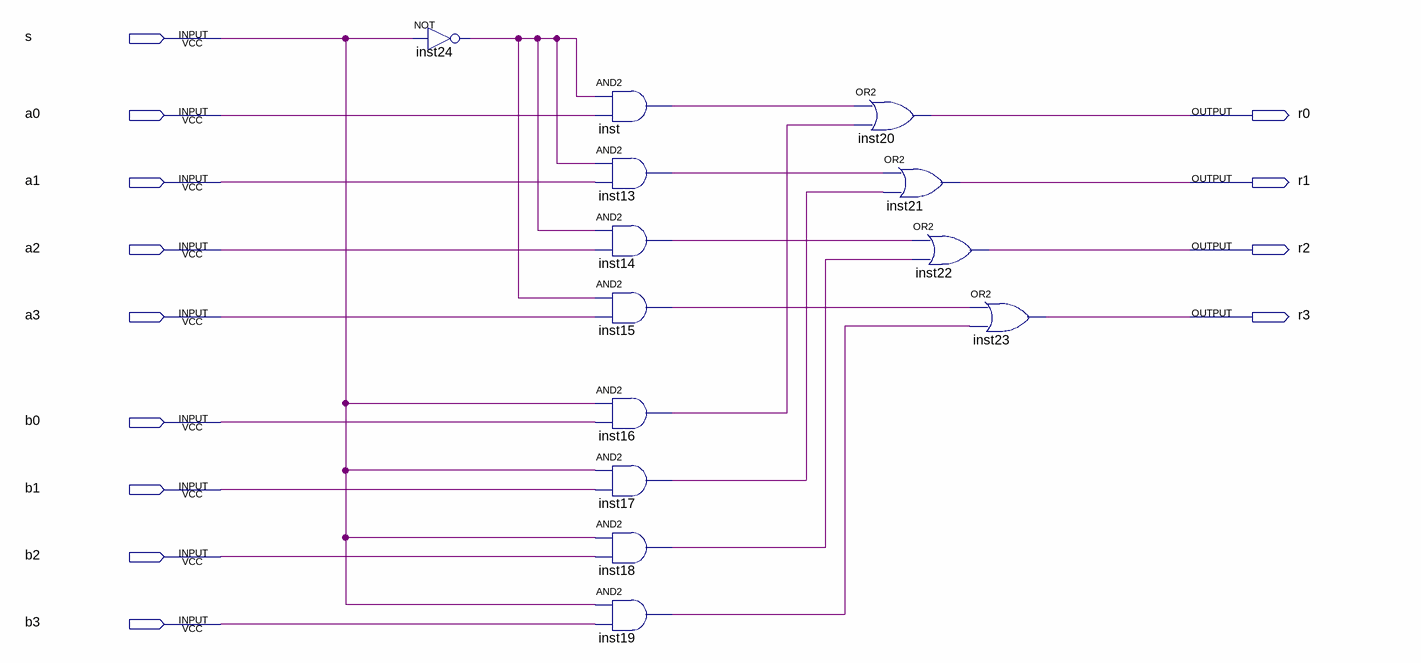
[diagram p0: schematic sheet]
// Quartus schematic demux-4-sd.bdf as structural Verilog: 13 symbols, 13 pins
module \demux-4-sd  (
  input  s,
  input  a0,
  input  a1,
  input  a2,
  input  a3,
  input  b0,
  input  b1,
  input  b2,
  input  b3,
  output r0,
  output r1,
  output r2,
  output r3
);

  wire inst13_out, inst14_out, inst15_out, inst16_out, inst17_out, inst18_out, inst19_out, inst24_out,
       inst_out;

  not inst24 (inst24_out, s);
  and inst (inst_out, inst24_out, a0);
  and inst13 (inst13_out, inst24_out, a1);
  and inst14 (inst14_out, inst24_out, a2);
  and inst15 (inst15_out, inst24_out, a3);
  and inst16 (inst16_out, s, b0);
  and inst17 (inst17_out, s, b1);
  and inst18 (inst18_out, s, b2);
  and inst19 (inst19_out, s, b3);
  or inst20 (r0, inst_out, inst16_out);
  or inst21 (r1, inst13_out, inst17_out);
  or inst22 (r2, inst14_out, inst18_out);
  or inst23 (r3, inst15_out, inst19_out);
endmodule
